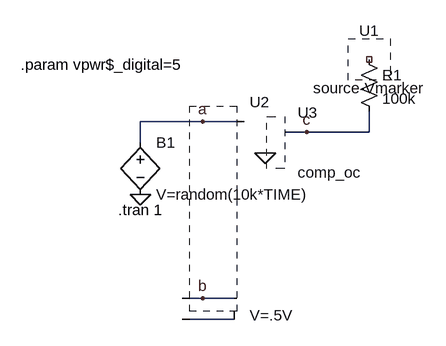
[diagram p0: schematic Draft2.asc]
Draft2.asc, the LTspice schematic file:
Version 4
SHEET 1 880 680
WIRE 224 96 128 96
WIRE 288 96 224 96
WIRE 384 112 352 112
WIRE 480 112 480 80
WIRE 480 112 384 112
WIRE 128 128 128 96
WIRE 224 368 192 368
WIRE 272 368 224 368
WIRE 272 400 192 400
FLAG 128 208 0
FLAG 224 96 a
FLAG 224 368 b
FLAG 384 112 c
FLAG 320 144 0
SYMBOL bv 128 112 R0
SYMATTR InstName B1
SYMATTR Value V=random(10k*TIME)
SYMBOL source-Vmarker 288 128 R0
SYMATTR Value V=.5V
SYMATTR InstName U2
SYMBOL EIT_Semiconductors\\comp_oc 320 112 R0
SYMATTR InstName U3
SYMBOL res 464 -16 R0
SYMATTR InstName R1
SYMATTR Value 100k
SYMBOL source-Vmarker 480 0 R0
SYMATTR InstName U1
TEXT 94 232 Left 2 !.tran 1
TEXT -56 8 Left 2 !.param vpwr$_digital=5

The netlist it stands for:
* Draft2.asc
B1 a 0 V=random(10k*TIME)
* U2: V=.5V (symbol source-Vmarker not available, pin order unknown); nets seen at it: a, b, N001
* U3: comp_oc (symbol EIT_Semiconductors\comp_oc not available, pin order unknown); nets seen at it: 0, c
R1 NC_01 c 100k
* U1: source-Vmarker (symbol source-Vmarker not available, pin order unknown); nets seen at it: 
.tran 1
.param vpwr$_digital=5
.backanno
.end